# EasyEDA Pro project PCB_NEW_PCB_2023-06-09.eprj

# Schematic Schematic1
Create Date: 2023-08-28; Page Name: P1; Project Name: PCB_NEW_PCB_2023-06-09; Schematic Name: Schematic1; Update Date: 2023-09-02; Company: 嘉立创EDA; Page Size: A4; Version: V1.0
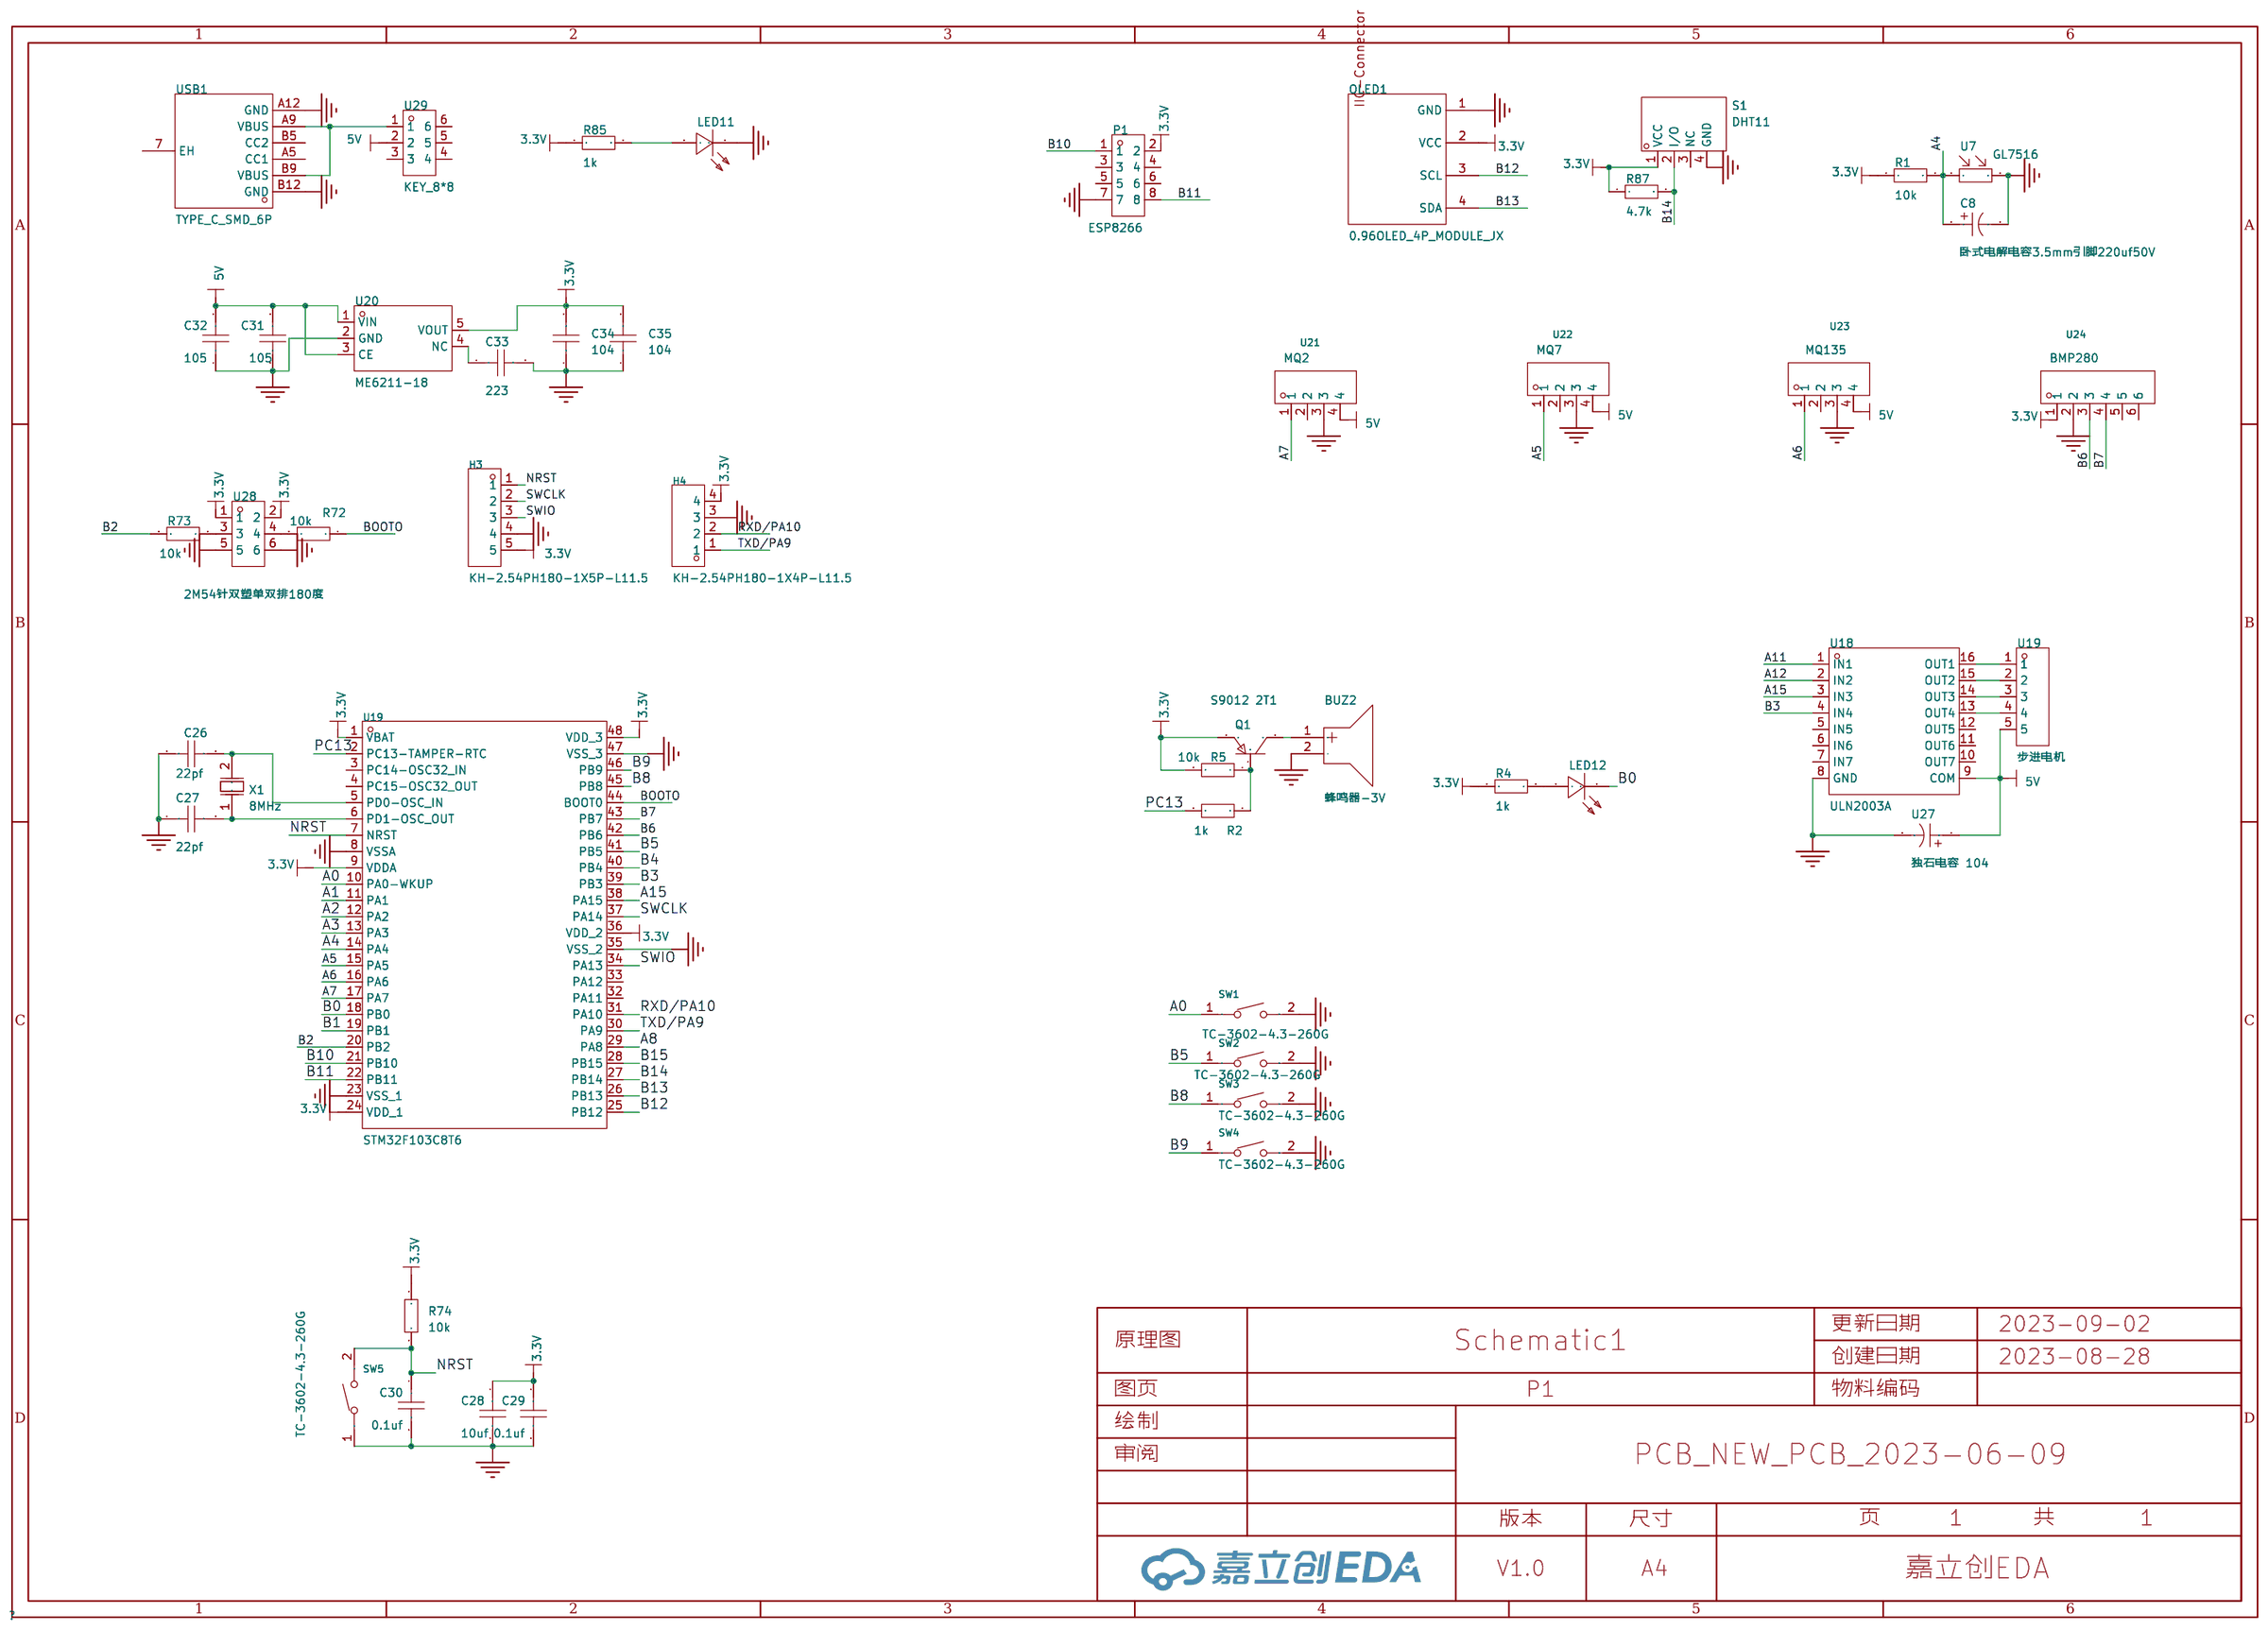
[diagram p0: schematic sheet]

## Parts
BUZ2  蜂鸣器-3V  [BUZ-TH_BD12.0-P7.60-D0.6-FD]
C8  卧式电解电容3.5mm引脚220uf50V  [CAP-TH_BD10.0-P5.00-D0.6-FD]
C26  22pf  [C0603]
C27  22pf  [C0603]
C28  10uf  [C0603]
C29  0.1uf  [C0603]
C30  0.1uf  [C0603]
C31  105  [C0603]
C32  105  [C0603]
C33  223  [C0603]
C34  104  [C0603]
C35  104  [C0603]
H3  KH-2.54PH180-1X5P-L11.5  [HDR-TH_5P-P2.54-V-M]
H4  KH-2.54PH180-1X4P-L11.5  [HDR-TH_4P-P2.54-V-M]
LED11  KT-0603R  [LED0603-RD]
LED12  KT-0603R  [LED0603-RD]
OLED1  0.96OLED_4P_MODULE_JX  [0.96OLED_4P]
P1  ESP8266  [HDR-TH_8P-P2.54-V-F-R2-C4-S2.54-1]
Q1  S9012 2T1  [SOT-23-3_L2.9-W1.3-P1.90-LS2.4-BR]
R1  10k  [R0603]
R2  1k  [R0603]
R4  1k  [R0603]
R5  10k  [R0603]
R72  10k  [R0603]
R73  10k  [R0603]
R74  10k  [R0603]
R85  1k  [R0603]
R87  4.7k  [R0603]
S1  DHT11  [SENSOR-TH_DHT11-1]
SW1  TC-3602-4.3-260G  [SW-SMD_L6.0-W3.5-LS8.2]
SW2  TC-3602-4.3-260G  [SW-SMD_L6.0-W3.5-LS8.2]
SW3  TC-3602-4.3-260G  [SW-SMD_L6.0-W3.5-LS8.2]
SW4  TC-3602-4.3-260G  [SW-SMD_L6.0-W3.5-LS8.2]
SW5  TC-3602-4.3-260G  [SW-SMD_L6.0-W3.5-LS8.2]
U7  GL7516  [RES-TH_L7.0-W5.9-P5.00-D0.5]
U18  ULN2003A  [DIP-16_L20.0-W6.4-P2.54-LS7.6-BL]
U19  STM32F103C8T6  [LQFP-48_L7.0-W7.0-P0.50-LS9.0-BL]
U19#2  步进电机  [CONN-TH_HEADER5]
U20  ME6211-18  [SOT-23-5_L2.9-W1.6-P0.95-LS2.8-BL]
U21  MQ2  [HDR-TH_4P-P2.54-V-F]
U22  MQ7  [HDR-TH_4P-P2.54-V-F]
U23  MQ135  [HDR-TH_4P-P2.54-V-F]
U24  BMP280  [HDR-TH_6P-P2.54-V-F]
U27  独石电容 104  [CAP-TH_BD6.3-P2.50-D0.5-FD]
U28  2M54针双塑单双排180度  [HDR-TH_6P-P2.54-V-M-R2-C3-S2.54-2]
U29  KEY_8*8  [KEY-TH_6P-L7.1-W7.1-P2.00]
USB1  TYPE_C_SMD_6P  [TYPE-C-SMD_TYPE-C-6P]
X1  8MHz  [CRYSTAL-SMD_L5.0-W3.2-1]

## Library data of the parts
BUZ2 = 蜂鸣器-3V: Supplier Part: C9900021444; Supplier Footprint: BUZ-TH; JLCPCB Part Class: 扩展库; Datasheet: https://atta.szlcsc.comnull; Supplier: LCSC
C8 = 卧式电解电容3.5mm引脚220uf50V: Supplier Part: C9900023990; Supplier Footprint: CAP-TH; JLCPCB Part Class: 扩展库; Datasheet: https://atta.szlcsc.comnull; Supplier: LCSC
C26-C35 = 0603贴片电容-D22040700184: Supplier Part: C9900013625; JLCPCB Part Class: 扩展库; Datasheet: https://atta.szlcsc.comnull; Supplier: LCSC
H3 = KH-2.54PH180-1X5P-L11.5: 排数:单排;总PIN位数:5;间距:2.54mm;插针结构:1x5P;行距:-;安装类型:直插;圆针/方针:方针;额定电流:3A;额定电压:-;配合针长度:6mm;塑高:2.5mm;端接针长度:3mm;工作温度范围:-40℃~+105℃;颜色:黑色;; LCSC Part Name: 2.54mm 1x5P 直插 方针; Supplier Part: C2932699; Manufacturer: kinghelm(金航标); Supplier Footprint: 直插,P=2.54mm; JLCPCB Part Class: 扩展库; Supplier: LCSC; Number of Rows: 单排; Number of Pins: 5; Pitch: 2.54mm; Pin Structure: 1x5P; Mounting Type: 直插; Circluar Pins/Square Pins: 方针; Current Rating (Max): 3A; Length of Mating Pin: 6mm; Insulation Height: 2.5mm; Length of End Connection Pin: 3mm; Operating Temperature Range: -40℃~+105℃; Color: 黑色
H4 = KH-2.54PH180-1X4P-L11.5: 排数:单排;总PIN位数:4P;间距:2.54mm;插针结构:1x4P;行距:-;安装类型:直插;圆针/方针:方针;额定电流:3A;额定电压:-;配合针长度:6mm;塑高:2.5mm;端接针长度:3mm;触头材质:-;工作温度范围:-40℃~+105℃;颜色:黑色;; LCSC Part Name: 2.54mm 1x4P 直插 方针; Supplier Part: C2905435; Manufacturer: kinghelm(金航标); Supplier Footprint: 插件,P=2.54mm; JLCPCB Part Class: 扩展库; Datasheet: https://atta.szlcsc.com/upload/public/pdf/source/20211019/06FD9EA041E66F176E900F61FE678D35.pdf; Supplier: LCSC; Number of Rows: 单排; Number of Pins: 4P; Pitch: 2.54mm; Pin Structure: 1x4P; Mounting Type: 直插; Circluar Pins/Square Pins: 方针; Current Rating (Max): 3A; Length of Mating Pin: 6mm; Insulation Height: 2.5mm; Length of End Connection Pin: 3mm; Operating Temperature Range: -40℃~+105℃; Color: 黑色
LED11 LED12 = KT-0603R: 发光颜色:红灯;二极管配置:-;透镜颜色:-;主波长:-;色温:-;功率:-;发光角度:-;安装方式:-;工作温度:-40℃~+85℃;; LCSC Part Name: 0603 红灯 高亮; Supplier Part: C2286; Manufacturer: KENTO; Supplier Footprint: 0603; Datasheet: https://atta.szlcsc.com/upload/public/pdf/source/20160616/1466072038404.pdf; Supplier: LCSC; Emitted Color: 红灯; Operating Temperature: -40℃~+85℃
OLED1 = 0.96OLED_4P_MODULE_JX: Supplier Part: C9900004566; Supplier Footprint: 插件; JLCPCB Part Class: 扩展库; Datasheet: https://atta.szlcsc.comnull; Supplier: LCSC
P1 = ESP8266-TH8: Supplier Part: C9900003199; Supplier Footprint: TH-8_4.9X10.6X2.54P; JLCPCB Part Class: 扩展库; Datasheet: https://atta.szlcsc.comnull; Supplier: LCSC
Q1 = S9012 2T1_C8543: 晶体管类型:PNP;集射极击穿电压(Vceo):25V;集电极电流(Ic):500mA;功率(Pd):300mW;集电极截止电流(Icbo):100nA;集电极-发射极饱和电压(VCE(sat)@Ic,Ib):600mV@500mA,50mA;直流电流增益(hFE@Ic,Vce):200@50mA,1V;特征频率(fT):150MHz;工作温度:+150℃@(Tj);; LCSC Part Name: PNP 25V 500mA; Supplier Part: C8543; Manufacturer: CJ(江苏长电/长晶); Supplier Footprint: SOT-23; JLCPCB Part Class: 基础库; Datasheet: https://atta.szlcsc.com/upload/public/pdf/source/20190306/C8543_216DBED79A4FB8D6A7BC605DE84B6D93.pdf; Supplier: LCSC; Transistor Type: PNP; Collector-Emitter Breakdown Voltage (Vceo): 25V; Collector Current (Ic): 500mA; Power Dissipation (Pd): 300mW; Collector Cut-Off Current (Icbo): 100nA; Collector-Emitter Saturation Voltage (VCE(sat)@Ic,Ib): 600mV@500mA,50mA; DC Current Gain (hFE@Ic,Vce): 200@50mA,1V; Transition Frequency (fT): 150MHz; Operating Temperature: +150℃@(Tj)
R1 R2 R4 R5 R72-R74 R85 R87 = 贴片电阻_0603_100K_±1%_1/10W: Supplier Part: C9900009623; JLCPCB Part Class: 扩展库; Datasheet: https://atta.szlcsc.comnull; Supplier: LCSC
S1 = DHT11_C87032: 温湿度模块，数字式，单总线; LCSC Part Name: DHT11  电阻式; Supplier Part: C87032; Supplier Footprint: 16.1mm*12.6mm*5.8mm; JLCPCB Part Class: 扩展库; Datasheet: https://atta.szlcsc.com/upload/public/pdf/source/20161119/1479540194449.pdf; Supplier: LCSC
SW1-SW5 = TC-3602-4.3-260G: 触点电流:50mA;额定电压(DC):12V;绝缘电阻:100MΩ;电路结构:单刀单掷;安装方式:立贴;带灯:无;作用力:260gf@±50gf;机械寿命:8万次;; Supplier Part: C2845293; Manufacturer: HCTL(华灿天禄); Supplier Footprint: SMD; JLCPCB Part Class: 扩展库; Supplier: LCSC; Contact Current: 50mA; Voltage Rating (DC): 12V; Insulation Resistance: 100MΩ; Circuit: 单刀单掷; Mounting Style: 立贴; Actuator Style: 方形按钮; Actuator/Cap Color: 白色; With Lamp: 无; Operating Force: 260gf@±50gf; Mechanical Life: 8万次; Operating Temperature: -25℃~+85℃; Pin Style: 鸥翼型; Switch Height: 4.3mm
U7 = GL7516: 光谱峰值(波长):-;最大电压:-;上升时间:-;下降时间:-;亮电阻 @ 10Lux:-;暗电阻:-;工作温度:-;; LCSC Part Name: 光敏电阻; Supplier Part: C559381; Manufacturer: JCHL(晶创和立); Supplier Footprint: 插件,P=5.1mm; JLCPCB Part Class: 扩展库; Datasheet: https://atta.szlcsc.com/upload/public/pdf/source/20200525/C559381_802C82F9F68B4547335E32FC54E50AAE.pdf; Supplier: LCSC
U18 = ULN2003A_C93000: Supplier Part: C93000; Manufacturer: ST(意法半导体); Supplier Footprint: DIP-16; JLCPCB Part Class: 扩展库; Datasheet: https://atta.szlcsc.com/upload/public/pdf/source/20171116/C93000_15108227945891124497.pdf; Supplier: LCSC
U19 = STM32F103C8T6: CPU内核:ARM Cortex-M3;CPU最大主频:72MHz;工作电压范围:2V~3.6V;内部振荡器:有;程序 FLASH容量:64K@x8bit;RAM总容量:20KB;EEPROM/数据 FLASH容量:-;GPIO端口数量:37;ADC(单元数/通道数/位数):1@x10ch/12bit;外设/功能/协议栈:看门狗；DMA；看门狗；片载温度传感器;工作温度范围:-40℃~+85℃;; LCSC Part Name: ARM Cortex-M3 72MHz 闪存：64K@x8bit RAM：20KB MSL=3; Supplier Part: C8734; Manufacturer: ST(意法半导体); Supplier Footprint: LQFP-48(7x7); JLCPCB Part Class: 基础库; Supplier: LCSC; CPU Core: ARM Cortex-M3; Maximum Frequency: 72MHz; Supply Voltage Range: 2V~3.6V; Internal Oscillator: 有; Program FLASH Size: 64K@x8bit; RAM Size: 20KB; GPIO Ports Number: 37; ADC (Units/Channels/bits): 1@x10ch/12bit; Peripherals / Functions / Protocol Stacks: 看门狗；DMA；看门狗；片载温度传感器; Operating Temperature Range: -40℃~+85℃
U19#2 = Header5: Supplier Part: C9900003337; Supplier Footprint: XH2.54-P5; JLCPCB Part Class: 扩展库; Supplier: LCSC
U20 = ME6211-18: Supplier Part: C9900015251; Supplier Footprint: SOT-23-5; JLCPCB Part Class: 扩展库; Datasheet: 2022-04-20/150958A/29a4b4dc59f84946b1698c391a943016/LN5053_C.pdf; Supplier: LCSC
U21-U23 = KH-2.54FH-1X4P-H8.5: 排数:单排;总孔位数:4P;间距:2.54mm;插孔结构:1x4P;行距:-;安装类型:直插;圆孔/方孔:方孔;额定电流:3A;额定电压:-;插孔方向:顶部;塑高:8.5mm;工作温度范围:-40℃~+105℃;; LCSC Part Name: 2.54mm 1x4P; Supplier Part: C2905415; Manufacturer: kinghelm(金航标); Supplier Footprint: 插件,P=2.54mm; JLCPCB Part Class: 扩展库; Datasheet: https://atta.szlcsc.com/upload/public/pdf/source/20211019/F01742C8B89DCA4810A857CC894DA6D1.pdf; Supplier: LCSC; Number of Rows: 单排; Number of Holes: 4P; Pitch: 2.54mm; Holes Structure: 1x4P; Mounting Type: 直插; Circular Hole / Square Hole: 方孔; Current Rating (Max): 3A; Holes Direction: 顶部; Insulation Height: 8.5mm; Operating Temperature Range: -40℃~+105℃
U24 = KH-2.54FH-1X6P-H8.5: 排数:单排;总孔位数:6;间距:2.54mm;插孔结构:1x6P;行距:-;安装类型:直插;圆孔/方孔:方孔;额定电流:3A;额定电压:-;插孔方向:顶部;塑高:8.5mm;工作温度范围:-40℃~+105℃;; LCSC Part Name: 2.54mm 1x6P; Supplier Part: C2905416; Manufacturer: kinghelm(金航标); Supplier Footprint: 直插,P=2.54mm; JLCPCB Part Class: 扩展库; Supplier: LCSC; Number of Rows: 单排; Number of Holes: 6; Pitch: 2.54mm; Holes Structure: 1x6P; Mounting Type: 直插; Circular Hole / Square Hole: 方孔; Current Rating (Max): 3A; Holes Direction: 顶部; Insulation Height: 8.5mm; Operating Temperature Range: -40℃~+105℃
U27 = 电解电容: Supplier Part: C9900022333; Supplier Footprint: CAP-TH; JLCPCB Part Class: 扩展库; Supplier: LCSC
U28 = 2M54针双塑单双排180度: Supplier Part: C9900032004; Supplier Footprint: 插件,2x3P,2.54mm; JLCPCB Part Class: 扩展库; Datasheet: 2022-10-10/05608A/402fa9dde51545a894b7980764cc843e/C071070-01.pdf; Supplier: LCSC
U29 = KEY_8*8: Supplier Part: C9900001793; Supplier Footprint: SW-TH_6P-L7.1-W7.1-P2.00-LS4.9; JLCPCB Part Class: 扩展库; Supplier: LCSC
USB1 = TYPE_C_SMD_6P: Supplier Part: C9900003080; Supplier Footprint: TYPE_C_USB_6P; JLCPCB Part Class: 扩展库; Supplier: LCSC
X1 = NX5032GA-8MHZ-EXS00A-CG07039: 频率:8MHz;频率公差:±20ppm;负载电容:18pF;; LCSC Part Name: 8MHz ±20ppm 18pF; Supplier Part: C1986270; Manufacturer: NDK; Supplier Footprint: SMD5032-2P; JLCPCB Part Class: 扩展库; Datasheet: https://atta.szlcsc.com/upload/public/pdf/source/20210606/BB00706F6C3C1326F79094723CB18925.pdf; Supplier: LCSC; Frequency Tolerance: ±20ppm; Frequency Stability: ±30ppm; Load Capacitance: 18pF; Equivalent Series Resistance (ESR): 300Ω; Operating Temperature: -40℃~+85℃

## Nets
3.3V: C28.1 C29.1 C34.2 C35.2 H3.5 H4.4 OLED1.2(VCC) P1.2 Q1.2(E) R1.1 R4.1 R5.2 R74.1 R85.1 R87.1 S1.1(VCC) U19.1(VBAT) U19.9(VDDA) U19.24(VDD_1) U19.36(VDD_2) U19.48(VDD_3) U20.5(VOUT) U24.1 U28.1 U28.2
5V: C31.2 C32.2 U18.9(COM) U19#2.5 U20.1(VIN) U20.3(CE) U21.4 U22.4 U23.4 U27.1 U29.2
GND: BUZ2.2(-) C8.2 C26.1 C27.1 C28.2 C29.2 C30.2 C31.1 C32.1 C33.2 C34.1 C35.1 H3.4 H4.3 LED11.1(K) OLED1.1(GND) P1.7 S1.4(GND) SW1.2 SW2.2 SW3.2 SW4.2 SW5.1 U7.2 U18.8(GND) U19.8(VSSA) U19.23(VSS_1) U19.35(VSS_2) U19.47(VSS_3) U20.2(GND) U21.3 U22.3 U23.3 U24.2 U27.2 U28.5 U28.6 USB1.A12(GND) USB1.B12(GND)
A0: SW1.1 U19.10(PA0-WKUP)
A1: U19.11(PA1)
A2: U19.12(PA2)
A3: U19.13(PA3)
A4: C8.1 R1.2 U7.1 U19.14(PA4)
A5: U19.15(PA5) U22.1
A6: U19.16(PA6) U23.1
A7: U19.17(PA7) U21.1
A8: U19.29(PA8)
A11: U18.1(IN1)
A12: U18.2(IN2)
A15: U18.3(IN3) U19.38(PA15)
B0: LED12.1(K) U19.18(PB0)
B1: U19.19(PB1)
B2: R73.2 U19.20(PB2)
B3: U18.4(IN4) U19.39(PB3)
B4: U19.40(PB4)
B5: SW2.1 U19.41(PB5)
B6: U19.42(PB6) U24.3
B7: U19.43(PB7) U24.4
B8: SW3.1 U19.45(PB8)
B9: SW4.1 U19.46(PB9)
B10: P1.1 U19.21(PB10)
B11: P1.8 U19.22(PB11)
B12: OLED1.3(SCL) U19.25(PB12)
B13: OLED1.4(SDA) U19.26(PB13)
B14: R87.2 S1.2(I/O) U19.27(PB14)
B15: U19.28(PB15)
BOOTO: R72.1 U19.44(BOOT0)
NRST: C30.1 H3.1 R74.2 SW5.2 U19.7(NRST)
PC13: R2.2 U19.2(PC13-TAMPER-RTC)
RXD/PA10: H4.2 U19.31(PA10)
SWCLK: H3.2 U19.37(PA14)
SWIO: H3.3 U19.34(PA13)
TXD/PA9: H4.1 U19.30(PA9)
Net-(BUZ2-1): BUZ2.1(+) Q1.3(C)
Net-(C26-2): C26.2 U19.5(PD0-OSC_IN) X1.2
Net-(C27-2): C27.2 U19.6(PD1-OSC_OUT) X1.1
Net-(C33-1): C33.1 U20.4(NC)
Net-(LED11-2): LED11.2(A) R85.2
Net-(LED12-2): LED12.2(A) R4.2
Net-(Q1-1): Q1.1(B) R2.1 R5.1
Net-(R72-2): R72.2 U28.4
Net-(R73-1): R73.1 U28.3
Net-(U18-13): U18.13(OUT4) U19#2.4
Net-(U18-14): U18.14(OUT3) U19#2.3
Net-(U18-15): U18.15(OUT2) U19#2.2
Net-(U18-16): U18.16(OUT1) U19#2.1
Net-(U29-1): U29.1 USB1.A9(VBUS) USB1.B9(VBUS)

Not connected (* = marked no-connect by the designer): P1 3 4 5 6; S1 3(NC); U18 5(IN5) 6(IN6) 7(IN7) 10(OUT7) 11(OUT6) 12(OUT5); U19 3(PC14-OSC32_IN) 4(PC15-OSC32_OUT) 32(PA11) 33(PA12); U21 2; U22 2; U23 2; U24 5 6; U29 3 4 5 6; USB1 7(EH) A5(CC1) B5(CC2)

# Board PCB_NEW_PCB_2023-06-09
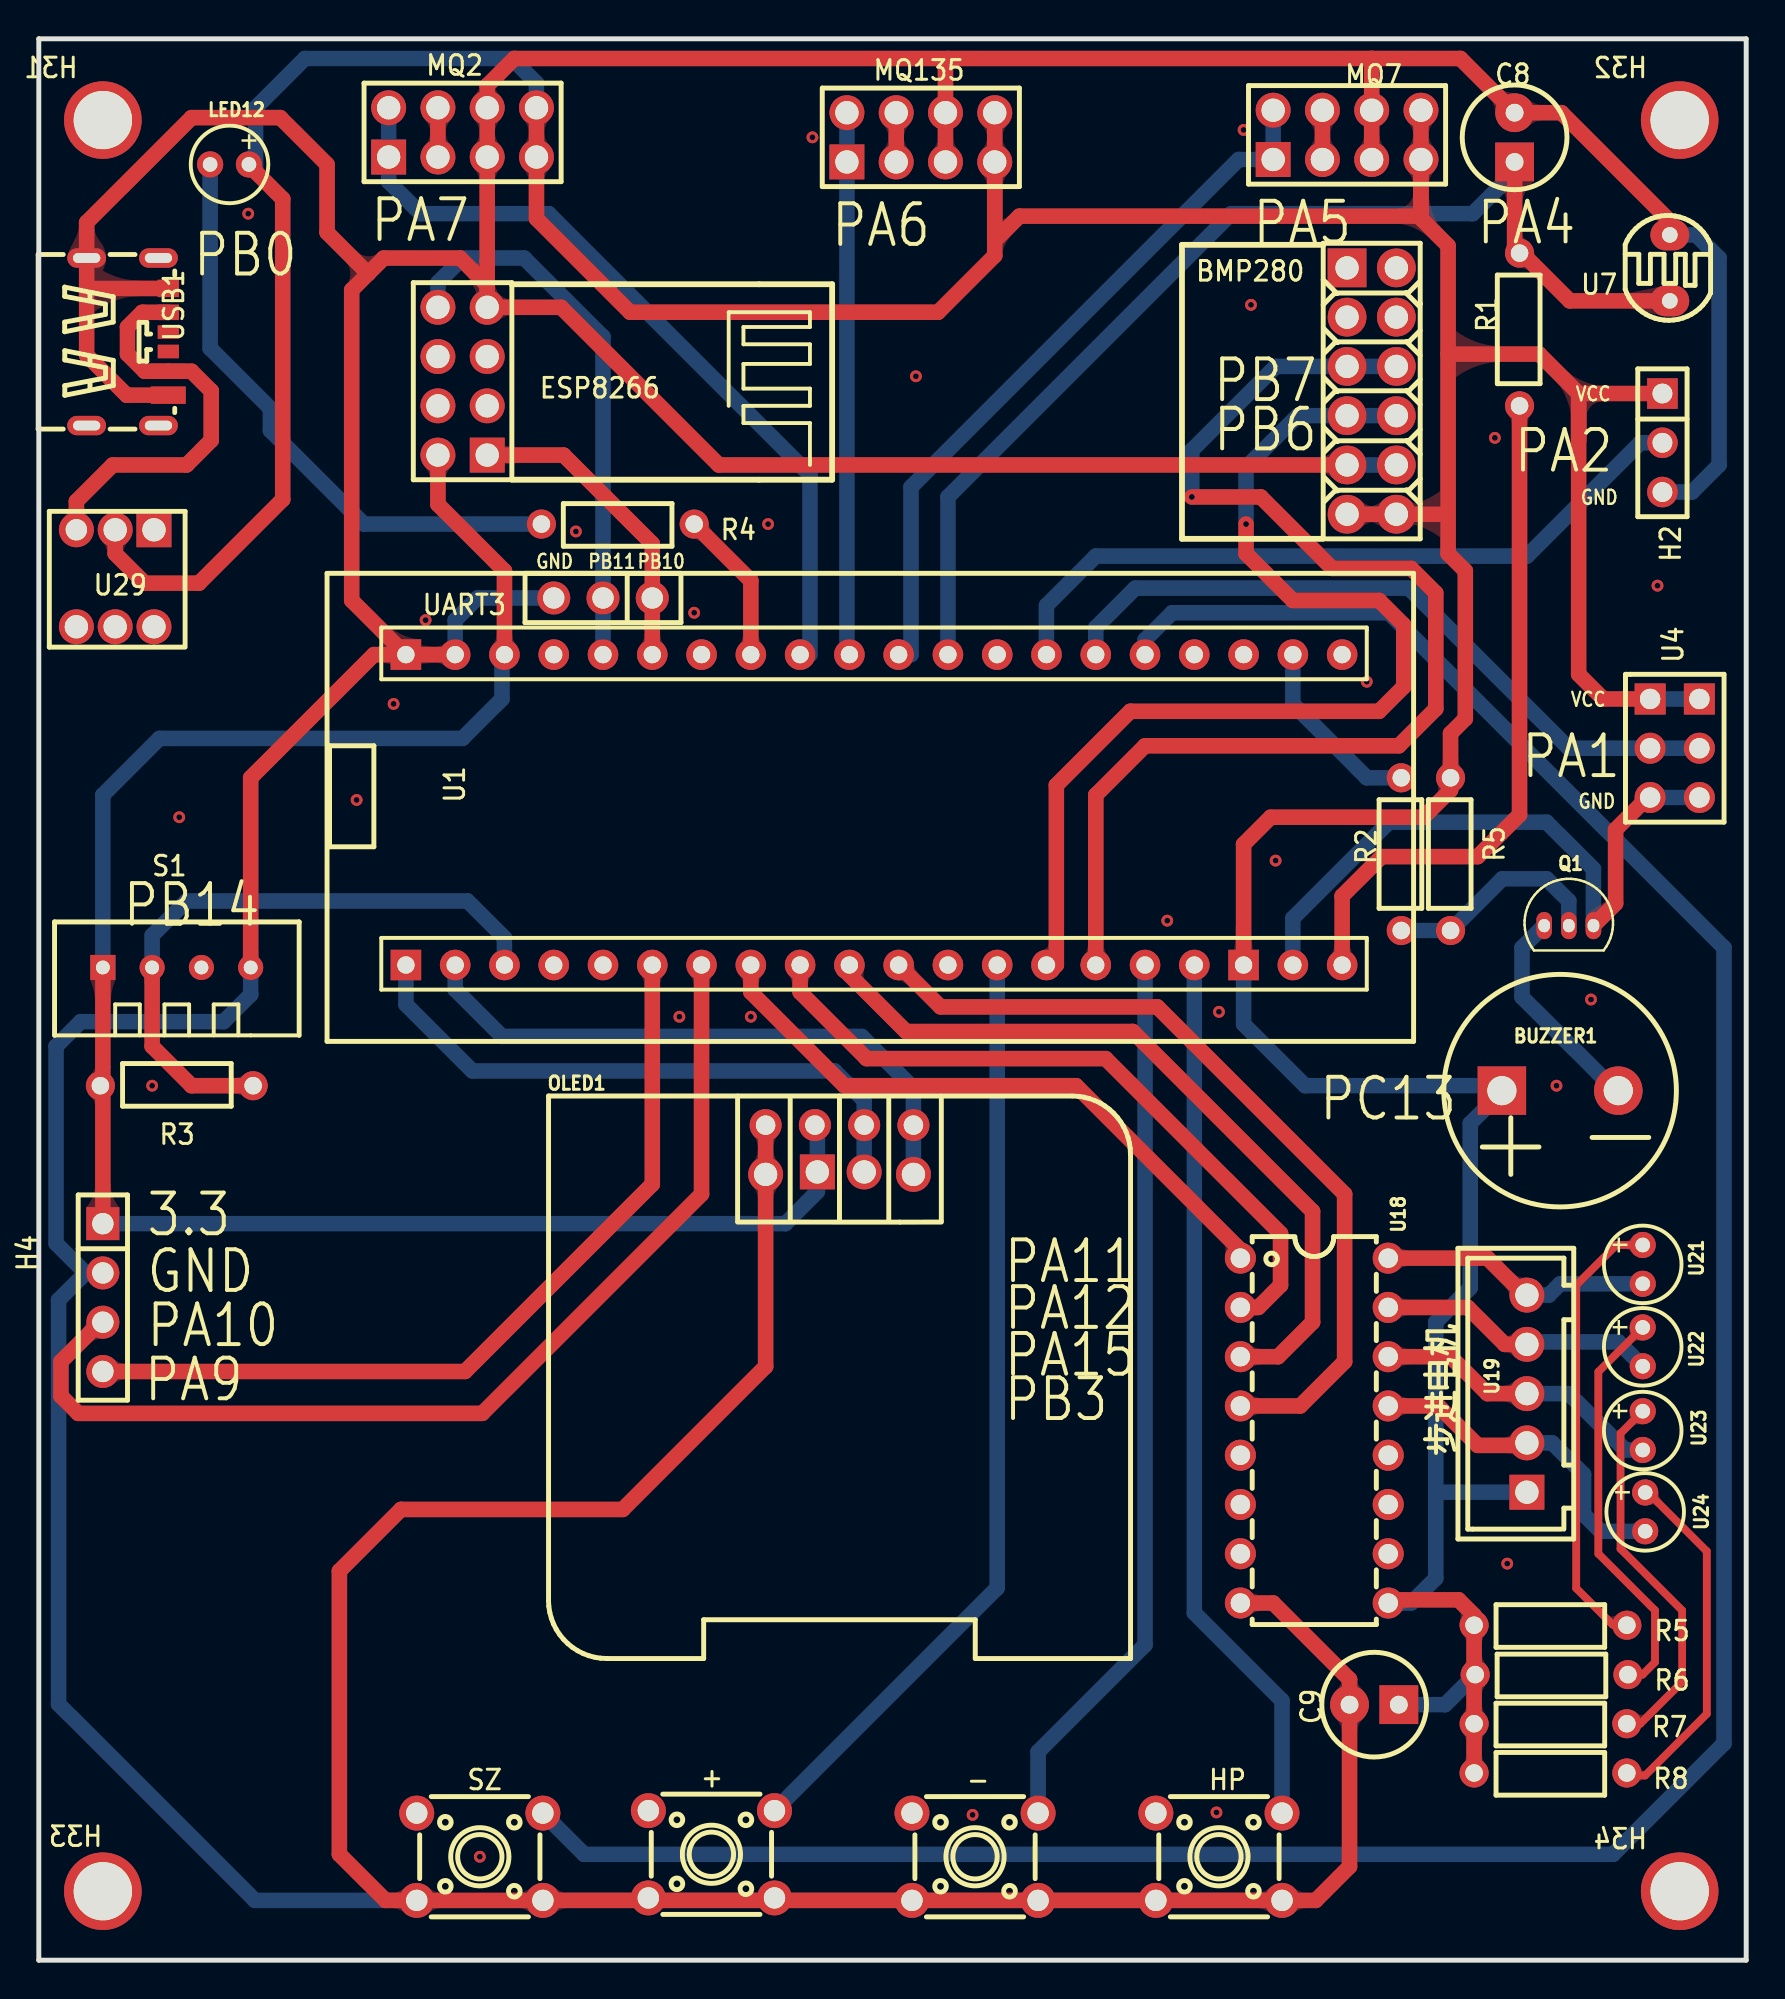
[diagram p1: board, top side]
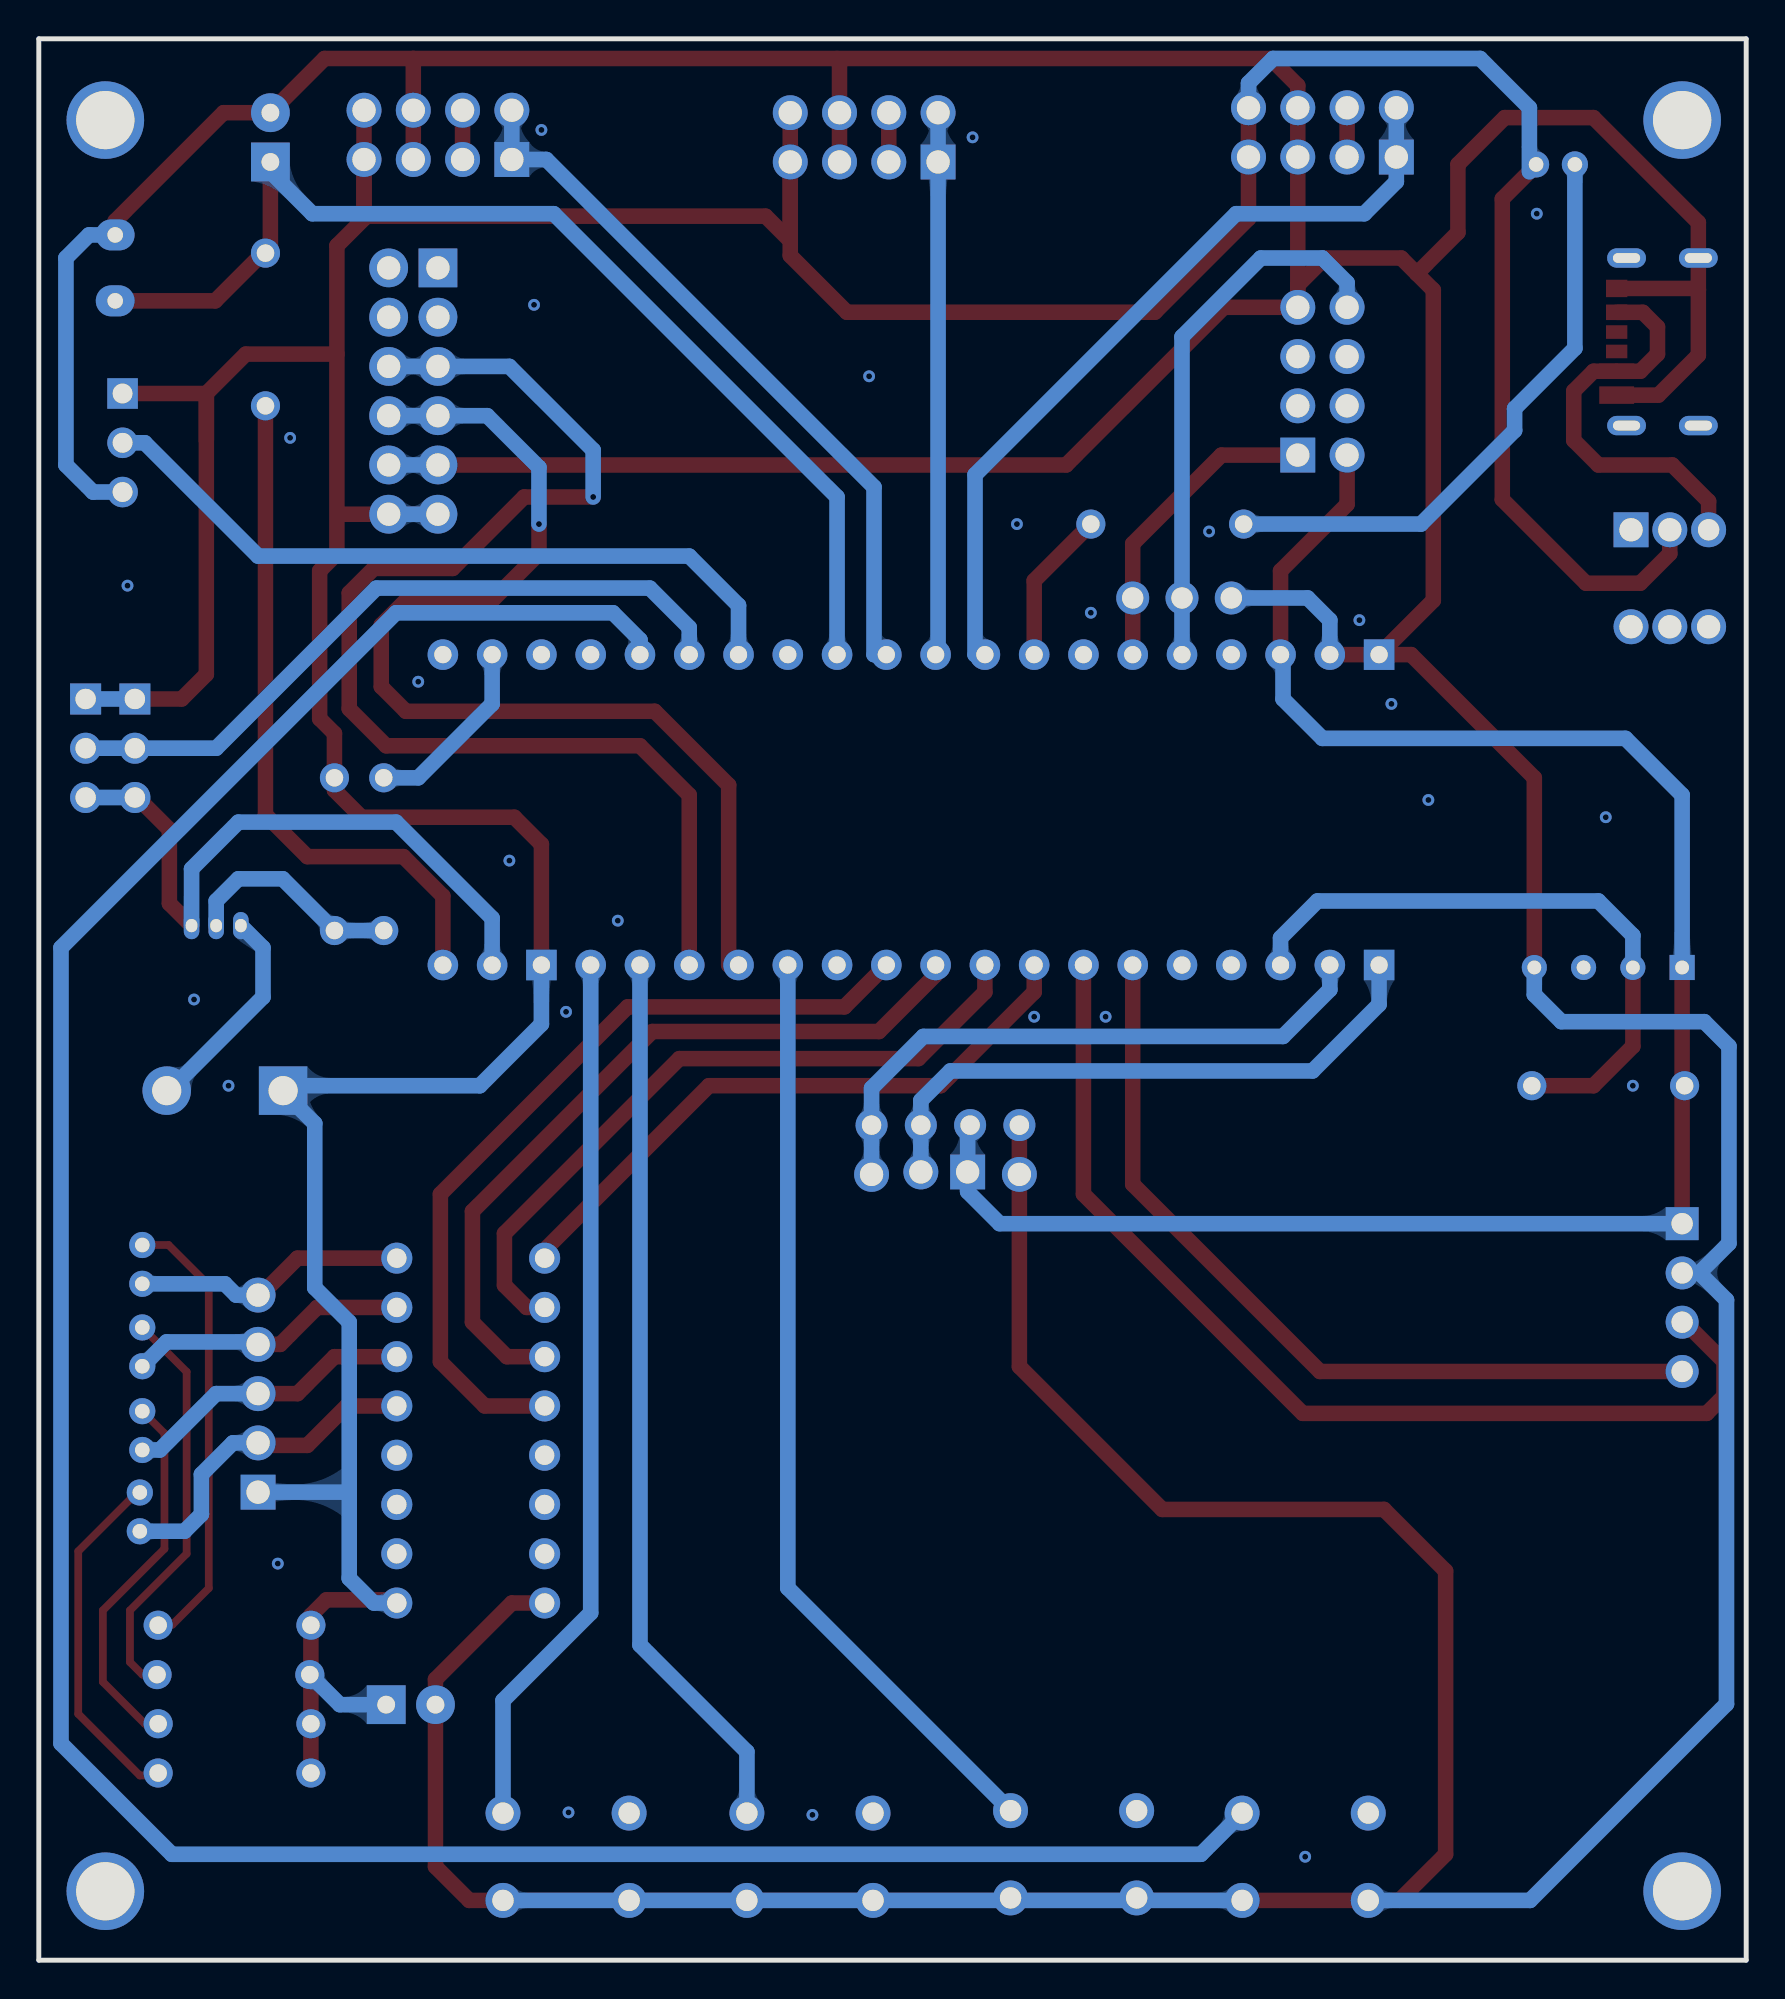
[diagram p2: board, bottom side, seen from below]

Outline 88.01 x 99.06 mm; copper layers: Top Layer, Bottom Layer. Coordinates in mm from the lower left corner of the outline.
Outline path: 0,99.06 88.01,99.06 88.01,0 0,0 0,99.06
Stack: Top Layer 0.035mm / Dielectric1 1.51mm FR4 er 4.5 / Bottom Layer 0.035mm

## Design rules (mm)
spacing Default (default): track to track 0.152, other pairs 0 to 0.152
track width Default (default): min 0.254, default 0.254, max 25.4
differential pair differentialPair (default): width min 0.127, default 0.254, max 2.54; gap min 0.152, default 0.152
via Default (default): diameter min 0.61, default 0.61, max 100.025; hole min 0.305, default 0.305, max 59.995
net GND uses gge49569
pour e340 uses gge49824
pour e566 uses gge49569

## Placement (name value [footprint] x y rotation side)
+  -  [KEY-TH_4P-L6.2-W6.2-P4.50-LS6.5]  34.67 5.46 0 top
-  -  [KEY-TH_4P-L6.2-W6.2-P4.50-LS6.5]  48.26 5.33 0 top
BMP280  -  [HDR-TH_12P-P2.54-V-M-R2-C6-S2.54_210S-2X6P]  68.71 80.9 270 top
BUZZER1  buzzer  [buz-th_bd12.0-p6.00-d0.9-rd]  78.42 44.83 180 top
C8  -  [电容]  76.07 93.98 90 top
C9  -  [电容]  68.83 13.17 180 top
ESP8266  -  [HDR-TH_8P-P2.54-V-R2-C4-S2.54_A2541WV-2X4P]  21.84 81.41 90 top
H2  -  [HDR-TH_3P-P2.54-V-F]  83.69 78.23 270 top
H4  -  [HDR-TH_4P-P2.54-V-F]  3.3 34.16 270 top
H31  -  [定位孔]  3.3 94.87 0 bottom
H32  -  [定位孔]  84.58 94.87 180 bottom
H33  -  [定位孔]  3.3 3.56 180 bottom
H34  -  [定位孔]  84.58 3.56 180 bottom
HP  -  [KEY-TH_4P-L6.2-W6.2-P4.50-LS6.5]  60.83 5.33 0 top
LED12  3mm-绿光-平头  [LED-TH_BD4.0-P2.00-D0.5-RD_GREEN]  9.83 92.58 0 top
MQ2  -  [HDR-TH_8P-P2.54-V-R2-C4-S2.54_A2541WV-2X4P]  21.84 94.23 0 top
MQ7  -  [HDR-TH_8P-P2.54-V-R2-C4-S2.54_A2541WV-2X4P]  67.44 94.11 0 top
MQ135  -  [HDR-TH_8P-P2.54-V-R2-C4-S2.54_A2541WV-2X4P]  45.47 93.98 0 top
NOREF  -  [Pad_e855]  40.13 40.64 270 top
NOREF#2  -  [Pad_e854]  37.46 40.51 270 top
NOREF#3  -  [Pad_e856]  42.55 40.64 270 top
NOREF#4  -  [Pad_e857]  45.08 40.51 270 top
OLED1  -  [0.96OLED_4P]  41.27 43.05 0 top
Q1  S9012  [TO-92-3_L4.6-W3.6-P1.27-L-1]  78.87 53.34 0 top
R1  -  [电阻]  75.18 81.28 90 top
R2  -  [电阻]  69.09 54.23 90 top
R3  -  [电阻]  4.32 46.23 0 top
R4  -  [电阻]  32.64 72.9 180 top
R5  -  [电阻]  80.72 16.13 180 top
R5#2  -  [电阻]  71.63 54.23 90 top
R6  -  [电阻]  80.77 13.58 180 top
R7  -  [电阻]  80.72 11.05 180 top
R8  -  [电阻]  80.72 8.51 180 top
S1  -  [SENSOR-TH_DHT11]  7.11 51.18 0 top
SZ  -  [KEY-TH_4P-L6.2-W6.2-P4.50-LS6.5]  22.73 5.33 0 top
U1  -  [STM32F103C8T6模块--蓝色]  42.93 59.94 90 top
U4  -  [HDR-TH_6P-P2.54-V-F-R2-C3-S2.54_A2541WV-2X3P]  84.33 62.48 270 top
U7  -  [光敏电阻]  84.07 87.25 0 top
U18  ULN2003A  [DIP-16_L20.0-W6.4-P2.54-LS7.6-BL]  65.75 27.3 270 top
U19  XH2.54_5p_DIP端子座  [conn-th_5p-p2.54_xh2.54_5p_dip]  76.71 29.21 90 top
U21  3mm-绿光-平头  [LED-TH_BD4.0-P2.00-D0.5-RD_GREEN]  82.68 35.87 90 top
U22  3mm-绿光-平头  [LED-TH_BD4.0-P2.00-D0.5-RD_GREEN]  82.68 31.62 90 top
U23  3mm-绿光-平头  [LED-TH_BD4.0-P2.00-D0.5-RD_GREEN]  82.68 27.3 90 top
U24  3mm-绿光-平头  [LED-TH_BD4.0-P2.00-D0.5-RD_GREEN]  82.8 23.11 90 top
U29  -  [KEY-TH_6P-L7.0-W7.0-P2.00]  3.94 71.25 180 top
UART3  -  [HDR-TH_3P-P2.54-V-M]  29.08 70.23 180 top
USB1  -  [TYPE-C-SMD_TYPE-C-31-M-16]  4.57 83.44 270 top

## Footprints (pads in the part's own frame, mm; a bottom-side part is the same pattern mirrored in y, then rotated)
0.96OLED_4P
  round 1.65 hole 1: 1(-3.81,-0.002) 2(-1.27,0.002) 3(1.27,0.002) 4(3.81,0.002)
buz-th_bd12.0-p6.00-d0.9-rd
  round 2.5 hole 1.5: 1(-3,0)
  rect 2.5x2.5 hole 1.5: 2(3,0)
conn-th_5p-p2.54_xh2.54_5p_dip
  round 1.8 hole 1.2: 1(5.08,0) 2(2.541,0) 3(0,0) 4(-2.539,0)
  rect 1.8x1.8 hole 1.2: 5(-5.08,0)
DIP-16_L20.0-W6.4-P2.54-LS7.6-BL
  round 1.6 hole 1: 1(-8.89,-3.81) 2(-6.35,-3.81) 3(-3.81,-3.81) 4(-1.27,-3.81) 5(1.27,-3.81) 6(3.81,-3.81) 7(6.35,-3.81) 8(8.89,-3.81) 9(8.89,3.81) 10(6.35,3.81) 11(3.81,3.81) 12(1.27,3.81) 13(-1.27,3.81) 14(-3.81,3.81) 15(-6.35,3.81) 16(-8.89,3.81)
HDR-TH_3P-P2.54-V-F
  rect 1.575x1.575 hole 1.02: 1(-2.54,0)
  round 1.575 hole 1.02: 2(0,0) 3(2.54,0)
HDR-TH_3P-P2.54-V-M
  round 1.7 hole 1.1: 1(-2.54,0) 2(0,0) 3(2.54,0)
HDR-TH_4P-P2.54-V-F
  rect 1.7x1.7 hole 1.1: 1(-3.81,0)
  round 1.7 hole 1.1: 2(-1.27,0) 3(1.27,0) 4(3.81,0)
HDR-TH_6P-P2.54-V-F-R2-C3-S2.54_A2541WV-2X3P
  rect 1.6x1.6 hole 1.05: 1(-2.54,-1.27) 2(-2.54,1.27)
  round 1.6 hole 1.05: 3(0,-1.27) 4(0,1.27) 5(2.54,-1.27) 6(2.54,1.27)
HDR-TH_8P-P2.54-V-R2-C4-S2.54_A2541WV-2X4P
  rect 1.8x1.8 hole 1.2: 1(-3.81,-1.27)
  round 1.8 hole 1.2: 2(-3.81,1.27) 3(-1.27,-1.27) 4(-1.27,1.27) 5(1.27,-1.27) 6(1.27,1.27) 7(3.81,-1.27) 8(3.81,1.27)
HDR-TH_12P-P2.54-V-M-R2-C6-S2.54_210S-2X6P
  rect 2x2 hole 1.2: 1(-6.35,-1.27)
  round 2 hole 1.2: 2(-6.35,1.27) 3(-3.81,-1.27) 4(-3.81,1.27) 5(-1.27,-1.27) 6(-1.27,1.27) 7(1.27,-1.27) 8(1.27,1.27) 9(3.81,-1.27) 10(3.81,1.27) 11(6.35,-1.27) 12(6.35,1.27)
KEY-TH_4P-L6.2-W6.2-P4.50-LS6.5
  round 1.8 hole 1.1: 1(-3.251,2.251) 2(3.251,2.251) 3(-3.251,-2.251) 4(3.251,-2.251)
KEY-TH_6P-L7.0-W7.0-P2.00
  rect 1.8x1.8 hole 1.2: 1(-2,-2.5)
  round 1.8 hole 1.2: 2(0,-2.5) 4(-2,2.5) 5(0,2.5) 6(2,2.5)
  round 1.8 hole 1.1: 3(2,-2.5)
LED-TH_BD4.0-P2.00-D0.5-RD_GREEN
  round 1.35 hole 0.75: 1(-1,0) 2(1,0)
Pad_e854
  round 1.8 hole 1.2: 4(0,0)
Pad_e855
  rect 1.8x1.8 hole 1.2: 5(0,0)
Pad_e856
  round 1.8 hole 1.2: 6(0,0)
Pad_e857
  round 1.8 hole 1.2: 7(0,0)
SENSOR-TH_DHT11
  rect 1.296x1.296 hole 0.711: 1(-3.81,0)
  round 1.296 hole 0.711: 2(-1.27,0) 3(1.27,0) 4(3.81,0)
STM32F103C8T6模块--蓝色
  rect 1.575x1.575 hole 0.889: 1(-8.636,24.003) 18(-8.636,-19.177) 40(7.366,24.003)
  round 1.575 hole 0.889: 2(-8.636,21.463) 3(-8.636,18.923) 4(-8.636,16.383) 5(-8.636,13.843) 6(-8.636,11.303) 7(-8.636,8.763) 8(-8.636,6.223) 9(-8.636,3.683) 10(-8.636,1.143) 11(-8.636,-1.397) 12(-8.636,-3.937) 13(-8.636,-6.477) 14(-8.636,-9.017) 15(-8.636,-11.557) 16(-8.636,-14.097) 17(-8.636,-16.637) 19(-8.636,-21.717) 20(-8.636,-24.257) 21(7.366,-24.257) 22(7.366,-21.717) 23(7.366,-19.177) 24(7.366,-16.637) 25(7.366,-14.097) 26(7.366,-11.557) 27(7.366,-9.017) 28(7.366,-6.477) 29(7.366,-3.937) 30(7.366,-1.397) 31(7.366,1.143) 32(7.366,3.683) 33(7.366,6.223) 34(7.366,8.763) 35(7.366,11.303) 36(7.366,13.843) 37(7.366,16.383) 38(7.366,18.923) 39(7.366,21.463)
TO-92-3_L4.6-W3.6-P1.27-L-1
  oval 0.8x1.4 hole 0.6x0.682: 1(-1.27,0) 2(0,0) 3(1.27,0)
TYPE-C-SMD_TYPE-C-31-M-16
  oval 1x2 hole 0.5x1.4: 1(-4.32,1.595) 2(4.32,1.595) 3(-4.32,-2.105) 4(4.32,-2.105)
  rect 0.7x1.1 smd: A5(-0.5,2.105) B5(0.5,2.105)
  rect 0.8x1.8 smd: A9(1.52,2.105)
  rect 0.9x1.8 smd: A12(2.75,2.105)
  rect 0.8x1.1 smd: B9(-1.52,2.105)
  rect 0.9x1.1 smd: B12(-2.75,2.105)
光敏电阻
  oval 2x1.6 hole 0.8: 1(0,1.7) 2(0,-1.7)
定位孔
  round 4 hole 3.005x3: 1(0,0)
电容
  rect 2x2 hole 0.914: 1(-1.27,0)
  round 2 hole 0.914: 2(1.27,0)
电阻
  round 1.5 hole 0.9: 1(-1.143,-1.143) 2(6.731,-1.143)

## Nets
GND: H31.1 H32.1 H33.1 H34.1
2: U18.16 U19.1 U21.1
3: U18.15 U19.2 U22.1
4: U18.14 U19.3 U23.1
5: U18.13 U19.4 U24.1
6: R5.1 U21.2
7: R6.1 U22.2
8: R7.1 U23.2
9: R8.1 U24.2
10: R4.1 U1.33
11: LED12.1 R4.2
12: H4.4 U1.6
S$8519: MQ135.1 MQ135.2 U1.31
S$8617: R1.1 U1.20
S$8640: BUZZER1.1 Q1.1
S$8650: ESP8266.1 U1.35
S$8672: ESP8266.8 U1.36
S$8697: R3.2 S1.2 U1.3
S$8704: NOREF#3.6 OLED1.3 U1.1
S$8705: NOREF#4.7 OLED1.4 U1.2
S$37608: H4.3 U1.7
S$48240: U1.17
S$48244: -.2 U1.16
S$48248: U1.13
S$48252: SZ.2 U1.25
S$49550: MQ7.1 MQ7.2 U1.30
S$49554: MQ2.1 MQ2.2 U1.32
S$68023: BMP280.9 BMP280.10 C8.2 C9.2 ESP8266.7 H4.2 HP.4 MQ2.5 MQ2.6 MQ7.5 MQ135.5 NOREF#2.4 OLED1.1 Q1.3 S1.4 SZ.3 SZ.4 U1.19 U1.39 U1.40 U7.1 U18.8 UART3.3 USB1.3 USB1.A12 USB1.B12
S$68886: C8.1 R1.2 U1.29 U7.2
S$74590: ESP8266.2 H4.1 NOREF.5 OLED1.2 R3.1 S1.1 U1.38
S$91322: U29.3 USB1.A9 USB1.B9
S$94623: BMP280.7 BMP280.8 U1.14
S$94627: BMP280.5 BMP280.6 U1.15
S$96373: U1.11 U18.4
S$96384: U1.9 U18.2
S$96388: U1.8 U18.1
S$96395: U1.10 U18.3
S$97397: MQ2.3 MQ2.4
S$97401: MQ135.3 MQ135.4
S$97405: MQ7.3 MQ7.4
S$99308: U1.26
S$99312: U1.27
S$99720: BMP280.11 BMP280.12 BUZZER1.2 C9.1 LED12.2 MQ2.7 MQ2.8 MQ7.7 MQ7.8 MQ135.7 MQ135.8 Q1.2 R2.1 R2.2 R5.2 R5#2.1 R5#2.2 R6.2 R7.2 R8.2 U1.18 U1.22 U18.9 U19.5 U29.2

Pads without a net: + 1 2 3 4; - 1 3 4; BMP280 1 2 3 4; ESP8266 3 4 5 6; H2 1 2 3; HP 1 2 3; MQ7 6; MQ135 6; S1 3; SZ 1; U1 4 5 12 21 23 24 28 34 37; U4 1 2 3 4 5 6; U18 5 6 7 10 11 12; U29 1 4 5 6; UART3 1 2; USB1 1 2 4 A5 B5

## Via types
v1: diameter 0.61, hole 0.305, Top Layer to Bottom Layer, 29 vias

## Routing (per net, layer and track width the routed paths; a pad name or vN(x,y) marks a point on that pad's centre or on a via; arc(x,y) is an arc through that point)
GND:
  vias: v1(5.84,45.08) v1(7.24,58.93) v1(10.79,90.04) v1(16.38,59.82) v1(18.29,64.77) v1(19.94,69.09) v1(22.73,5.33) v1(27.69,73.66) v1(33.02,48.64) v1(33.78,69.47) v1(36.7,48.64) v1(37.59,74.04) v1(39.88,93.98) v1(45.21,81.66) v1(48.13,7.49) v1(58.17,53.59) v1(60.71,7.62) v1(60.83,48.89) v1(62.1,94.36) v1(62.48,85.34) v1(63.75,56.69) v1(68.45,65.91) v1(75.06,78.49) v1(75.69,20.45) v1(78.23,45.08) v1(80.01,49.53) v1(83.44,70.87)
2: length 14.3
  Top Layer w0.8: U18.16 74.68,36.19 76.71,34.16 76.83,34.16
  Bottom Layer w0.8: U21.1 78.42,34.87 77.84,34.29 U19.1
3: length 14.7
  Top Layer w0.8: 69.56,33.66 73.66,33.66 75.56,31.75 U19.2
  Bottom Layer w0.8: 76.52,31.62 76.77,31.88 81.42,31.88 U22.1
4: length 15
  Top Layer w0.8: 76.58,29.21 74.68,29.21 72.77,31.11 U18.14
  Bottom Layer w0.8: U23.1 81.77,26.3 78.87,29.21 U19.3
5: length 17.2
  Top Layer w0.8: U18.13 72.14,28.57 74.17,26.54 76.71,26.54
  Bottom Layer w0.8: U24.1 80.5,22.11 79.63,22.99 79.63,25.05 78.01,26.67 U19.4
6: length 23.3
  Top Layer w0.4: U21.2 81.32,36.87 79.25,34.8 79.25,19.18 81.12,17.3 81.83,17.3 R5.1
7: length 21.1
  Top Layer w0.4: R6.1 82.67,14.72 83.31,15.37 83.31,18.03 80.39,20.95 80.39,30.34 U22.2
8: length 19.5
  Top Layer w0.4: R7.1 82.55,12.19 84.71,14.35 84.71,18.03 81.53,21.21 81.53,27.16 U23.2
9: length 18.5
  Top Layer w0.4: U24.2 82.95,24.11 85.98,21.08 85.98,12.7 82.8,9.53 82.49,9.53 81.86,10.16
10: length 7.9
  Top Layer w0.8: R4.1 36.7,71.12 U1.33
11: length 31
  Bottom Layer w0.8: LED12.1 8.83,83.11 11.94,80 11.94,78.87 16.76,74.04 R4.2
12: length 43.6
  Top Layer w0.8: U1.6 31.62,40 21.97,30.35 H4.4
S$8519: length 28.2
  Bottom Layer w0.8: U1.31 41.66,67.44 MQ135.1 ; MQ135.2 41.66,93.09 41.27,92.71
S$8617: length 35.5
  Top Layer w0.8: R1.1 76.33,59.05 74.17,56.9 69.21,56.9 67.18,54.86 U1.20
S$8640: length 10.6
  Bottom Layer w0.8: Q1.1 76.45,52.2 76.45,49.66 80.88,45.23 80.73,45.08
S$8650: length 16.1
  Top Layer w0.8: ESP8266.1 27.05,77.6 31.62,73.02 U1.35
S$8672: length 28.4
  Bottom Layer w0.8: 29.08,67.31 29.08,83.69 25.02,87.76 21.84,87.76 20.57,86.49 ESP8266.8
S$8697: length 32.8
  Top Layer w0.8: R3.2 7.87,45.08 5.84,47.12 S1.2
  Bottom Layer w0.8: S1.2 5.84,52.83 7.62,54.61 22.1,54.61 24,52.7 U1.3
S$8704: length 31.4
  Bottom Layer w0.8: NOREF#3.6 OLED1.3 42.55,44.32 41.02,45.85 22.35,45.85 18.92,49.28 18.92,51.31
S$8705: length 31.4
  Bottom Layer w0.8: NOREF#4.7 OLED1.4 45.08,44.96 42.42,47.62 23.88,47.62 21.46,50.04 21.46,51.31
S$37608: length 54.7
  Top Layer w0.8: U1.7 34.16,39.5 22.86,28.19 2.03,28.19 1.14,29.08 1.14,30.86 3.17,32.89 H4.3
S$48240: length 45.6
  Bottom Layer w0.8: U1.17 59.56,17.91 64.08,13.39 64.08,7.58
S$48244: length 46
  Bottom Layer w0.8: 51.51,7.58 51.51,10.74 57.02,16.26 57.02,51.31
S$48248: length 48.4
  Bottom Layer w0.8: 37.92,7.71 49.4,19.19 U1.13
S$48252: length 143.5
  Bottom Layer w0.8: 57.02,67.31 57.02,68.07 58.42,69.47 69.6,69.47 86.87,52.2 86.87,11.18 81.15,5.46 28.11,5.46 SZ.2
S$49550: length 37.5
  Bottom Layer w0.8: MQ7.2 MQ7.1 61.85,92.84 44.96,75.95 44.96,67.31 U1.30
S$49554: length 41.6
  Bottom Layer w0.8: MQ2.2 MQ2.1 18.03,91.69 19.68,90.04 26.29,90.04 39.75,76.58 39.75,67.31 39.24,67.31
S$68023: length 522.7
  Top Layer w0.3: 18.92,67.31 21.46,67.31
  Top Layer w0.8: 68.71,98.04 73.28,98.04 C8.2 78.49,95.25 84.07,89.66 U7.1 ; 68.71,98.04 24.51,98.04 23.11,96.65 MQ2.6 MQ2.5 ESP8266.7 ; 68.71,98.04 68.71,92.84 ; 16.98,86.95 17.78,87.76 21.72,87.76 23.11,86.36 ESP8266.7 ; 16.98,86.95 16.13,86.11 16.13,70.1 18.92,67.31 ; 16.98,86.95 14.86,89.08 14.86,92.58 12.45,95 7.87,95 2.47,89.59 USB1.3 2.47,86.11 ; 2.47,86.11 2.47,82.75 4.53,80.69 USB1.A12 ; 2.47,86.11 2.54,86.19 USB1.B12 ; MQ135.5 46.74,97.73 46.86,98.04 ; 37.59,43.05 37.46,42.93 NOREF#2.4 37.46,30.61 30.1,23.24 18.67,23.24 15.49,20.07 15.49,5.46 17.87,3.08 SZ.3 SZ.4 HP.4 65.82,3.08 67.56,4.83 C9.2 67.56,14.48 63.63,18.41 62.48,18.41 ; 18.92,67.31 21.46,67.31 ; 18.92,67.31 17.27,67.31 10.92,60.96 S1.4 ; 82.93,59.94 81.28,58.29 81.28,54.48 Q1.3 ; ESP8266.7 26.92,85.22 35.05,77.09 67.44,77.09
  Bottom Layer w0.8: SZ.3 11.14,3.08 1.02,13.21 1.02,34.04 2.41,35.43 ; 2.41,35.43 0.89,36.96 0.89,47.12 2.16,48.39 9.52,48.39 10.92,49.78 S1.4 ; 2.41,35.43 H4.2 ; SZ.4 HP.4 ; Q1.3 80.14,56.26 77.72,58.67 69.6,58.67 64.64,53.72 64.64,51.31 ; 67.44,77.09 BMP280.10 ; UART3.3 22.61,70.23 21.46,69.09 21.46,67.31 ; 83.69,75.69 85.22,75.69 86.61,77.09 86.61,87.76 85.42,88.95 U7.1 ; 82.93,59.94 85.47,59.94
S$68886: length 58.3
  Top Layer w0.8: 84.07,85.55 78.92,85.55 76.07,88.39 C8.1
  Bottom Layer w0.8: C8.1 76.07,92.2 73.91,90.04 61.47,90.04 46.86,75.44 46.86,67.31
S$74590: length 100.1
  Top Layer w0.8: H4.1 3.3,44.96 R3.1 3.3,45.21 S1.1 ; ESP8266.2 20.57,75.06 24,71.63 U1.38
  Bottom Layer w0.4: OLED1.2 40.13,42.93
  Bottom Layer w0.8: U1.38 23.88,67.18 23.88,65.02 21.84,62.99 6.22,62.99 3.3,60.07 S1.1 ; 40.13,42.93 NOREF.5 ; NOREF.5 40.13,39.62 38.48,37.97 H4.1 ; NOREF.5 40,40.51
S$91322: length 21.2
  Top Layer w0.8: 1.94,73.75 1.94,75.22 3.81,77.09 7.62,77.09 8.89,78.36 8.89,80.9 7.87,81.92 USB1.A9 5.46,81.92 4.57,82.8 4.57,84.2 5.33,84.96 USB1.B9
S$94623: length 55.9
  Top Layer w0.8: v1(62.23,74.04) 62.23,72.52 64.64,70.1 69.09,70.1 70.36,68.83 70.36,65.66 69.09,64.39 56.26,64.39 52.45,60.58 52.45,51.31 U1.14
  Bottom Layer w0.8: 69.98,79.63 64.9,79.63 62.23,76.96 v1(62.23,74.04)
S$94627: length 63.5
  Top Layer w0.8: v1(59.44,75.44) 62.99,75.44 66.67,71.75 70.74,71.75 72.01,70.48 72.01,64.52 70.1,62.61 57.02,62.61 54.48,60.07 U1.15
  Bottom Layer w0.8: BMP280.6 63.75,82.17 59.44,77.85 v1(59.44,75.44)
S$96373: length 42.8
  Top Layer w0.8: U1.11 46.48,49.15 57.66,49.15 67.31,39.5 67.31,30.86 65.02,28.57 U18.4
S$96384: length 36.5
  Top Layer w0.8: 61.94,33.66 62.86,33.66 64.01,34.8 64.01,37.46 54.99,46.48 42.67,46.48 39.24,49.91 39.24,51.31
S$96388: length 32.6
  Top Layer w0.8: U1.8 36.7,49.91 41.53,45.08 53.47,45.08 61.94,36.61 U18.1
S$96395: length 39.6
  Top Layer w0.8: U1.10 41.78,50.8 44.7,47.88 56.39,47.88 65.66,38.61 65.66,32.89 63.88,31.11 U18.3
S$97397: length 2.5
  Top Layer w0.8: MQ2.4 MQ2.3
S$97401: length 2.5
  Top Layer w0.8: MQ135.4 MQ135.3
S$97405: length 2.5
  Top Layer w0.8: MQ7.4 MQ7.3
S$99308: length 36.6
  Bottom Layer w0.8: 85.47,62.48 78.87,62.48 70.61,70.74 56.52,70.74 54.48,68.71 U1.26
S$99312: length 37.8
  Bottom Layer w0.8: U1.27 51.94,69.85 54.48,72.39 76.71,72.39 82.55,78.23 83.69,78.23
S$99720: length 307.9
  Top Layer w0.8: 83.69,80.77 79.37,80.77 ; 79.37,80.77 79.37,78.36 ; 79.37,80.77 79.37,66.29 80.64,65.02 82.93,65.02 ; 79.37,80.77 77.34,82.8 72.64,82.8 ; MQ7.7 71.25,89.79 72.64,88.39 72.64,72.52 73.53,71.63 73.53,64.01 72.77,63.25 R5#2.2 72.77,60.32 71.37,58.93 63.5,58.93 62.1,57.53 U1.18 ; MQ135.8 49.28,93.09 48.89,92.71 ; 11.18,92.2 12.57,90.8 12.57,75.31 8.25,70.99 5.46,70.99 3.94,72.52 3.94,73.75 ; 67.44,74.55 72.52,74.55 ; MQ7.8 71.25,89.92 50.55,89.92 49.28,88.65 MQ135.7 49.28,87.88 46.36,84.96 30.48,84.96 25.65,89.79 MQ2.7 MQ2.8 ; 69.85,18.67 69.94,18.58 73.18,18.58 73.98,17.78 R8.2
  Bottom Layer w0.8: 11.18,92.2 11.18,95.5 13.72,98.04 24.38,98.04 25.65,96.77 MQ2.8 ; U19.5 72.18,24.13 72.01,23.96 ; 70.1,18.41 70.74,18.41 72.01,19.69 72.01,23.96 ; U1.18 62.1,48.26 65.28,45.08 75.73,45.08 73.79,43.14 73.79,34.67 72.01,32.89 72.01,23.96 ; 64.64,67.31 64.64,64.77 68.45,60.96 R2.2 ; R6.2 72.49,13.17 C9.1 ; R2.1 R5#2.1 75.44,55.75 77.72,55.75 78.87,54.61 Q1.2 ; 82.93,65.02 85.47,65.02 ; 67.44,74.55 69.98,74.55

## Copper pours and planes (outline as drawn; the poured copper is in the pictures)
GND on Top Layer: -4.57,103.38 89.53,103.38 89.66,103.5 89.66,-0.76 -4.45,-0.76
GND on Bottom Layer: -1.52,100.97 89.92,100.97 90.04,101.09 90.04,-3.18 -1.4,-3.18

Small or netless copper shapes (teardrops, artwork), in the pictures only: 138 on Top Layer, 88 on Bottom Layer

## Text on the board
Top Silkscreen Layer: GND | PB11 | PB10 | VCC | PB14 | PA9 | 3.3 | PA10 | PB0 | PA7 | PA6 | PA11 | PA12 | PA15 | PB3 | PB7 | PB6 | PA5 | PC13 | PA4 | PA2 | PA1 | 步进电机
